# Altium schematic sheet Sata.SCHDOC: Ixora
size A3; Organization: Toradex AG; Address1: Altsagenstrasse 5; Address2: Horw; Address3: 6048; Address4: Switzerland; DocumentNumber: 17; Revision: V1.1; SheetNumber: 13; SheetTotal: 17; PageSetup: Record=PageOptions|CenterHorizontal=True|CenterVertical=True|PrintScale=0.73|XCorrection=1.00|YCorrection=1.00|PrintKind=0|BorderSize=5000000|LeftOffset=0|BottomOffset=0|Orientation=2|PaperLength=1000|PaperWidth=1000|Scale=100|PaperSource=7|PrintQuality=-4|MediaType=1|DitherType=10|PaperKind=A4|PrintScaleMode=1
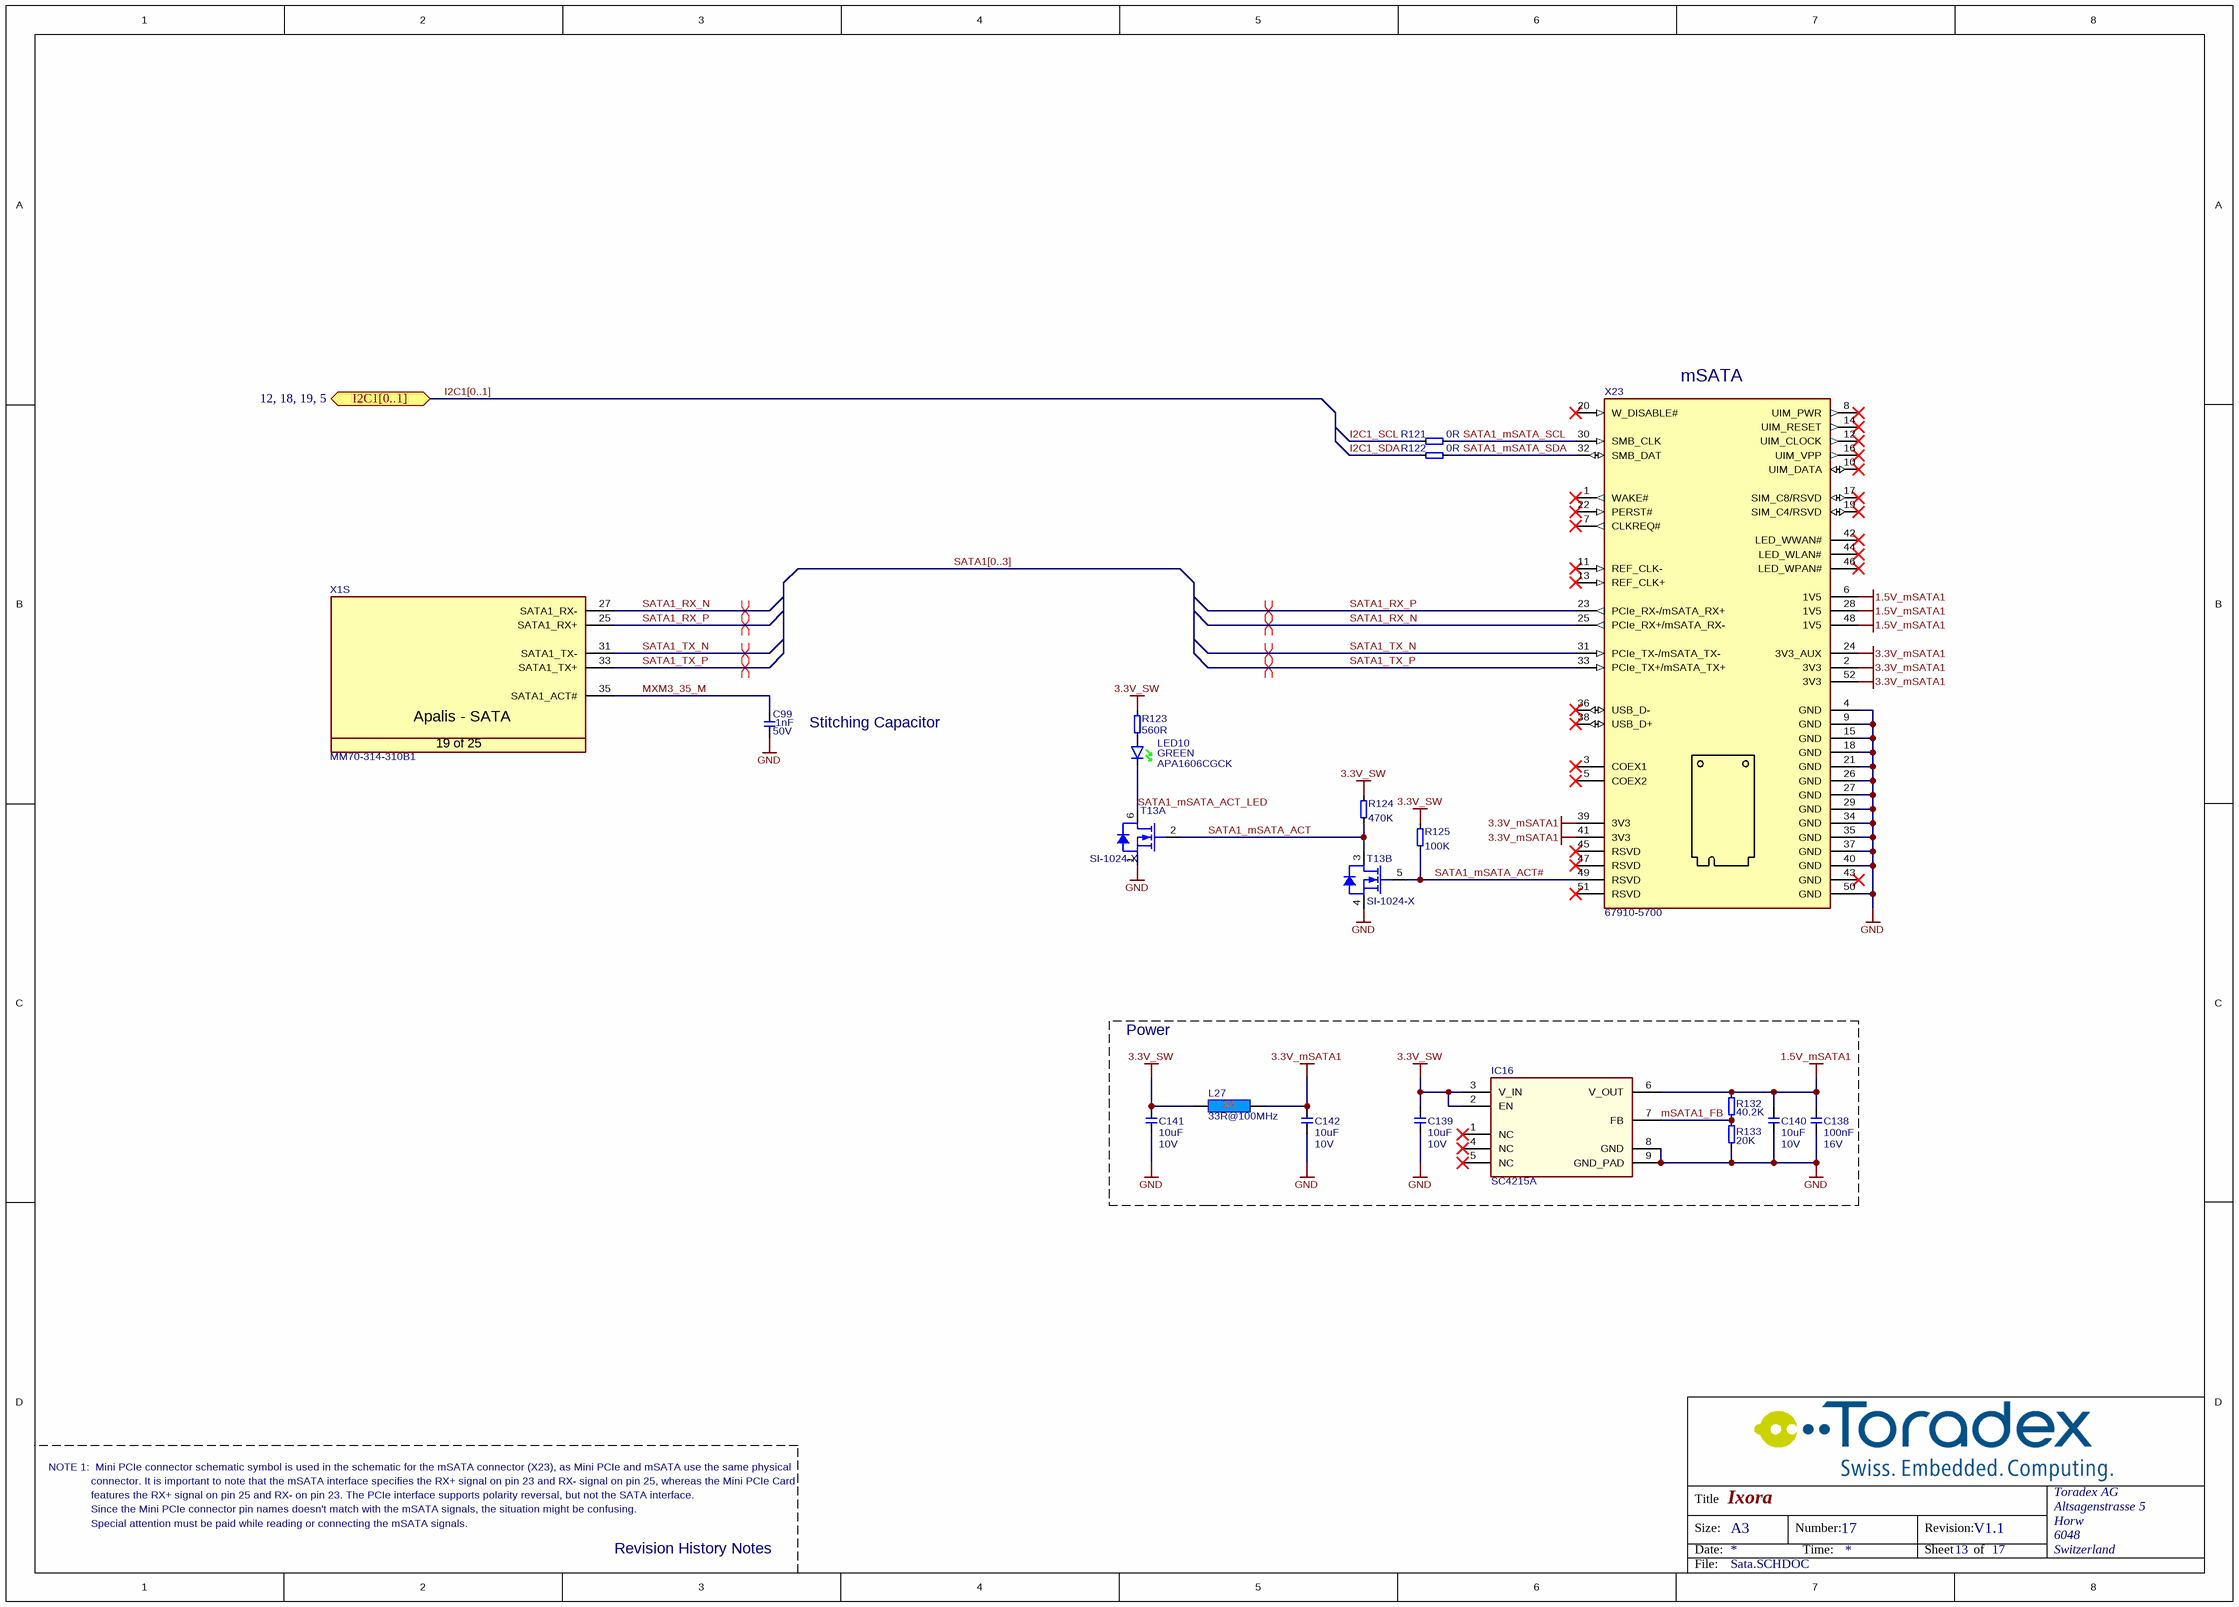
[diagram p0: Sata.SCHDOC]

## Parts
C99  Rating: 50V  [CAPC1005X60N]  (hidden comment: 1nF)
C138  Rating: 16V  [CAPC1005X60N]  (hidden comment: 100nF)
C139  Rating: 10V  [T_CAPC0603X33N]  (hidden comment: 10uF)
C140  Rating: 10V  [T_CAPC0603X33N]  (hidden comment: 10uF)
C141  Rating: 10V  [T_CAPC0603X33N]  (hidden comment: 10uF)
C142  Rating: 10V  [T_CAPC0603X33N]  (hidden comment: 10uF)
IC16  Manufacturer Part No.: SC4215A  [SOIC127P650X175_HS-8N]  (hidden comment: IC-Semtech-SC4215A)
L27  33R@100MHz  [INDC1608X95N]
LED10  Color: GREEN  [T_Kingbright_APA1606CGCK]  (hidden comment: APA1606CGCK)
R121  0R  [RESC1005X40N]
R122  0R  [RESC1005X40N]
R123  560R  [RESC1005X40N]
R124  470K  [RESC1005X40N]
R125  100K  [RESC1005X40N]
R132  40.2K  [RESC1005X40N]
R133  20K  [RESC1005X40N]
T13  Manufacturer Part No.: SI-1024-X  [SOTFL50P160X60-6N]  (hidden comment: T-Vishay-SI-1024X-N)  (parts A,B of 2)
X1  Manufacturer Part No.: MM70-314-310B1  [T_JAE_MM70-314-310B1]  (hidden comment: CON-JAE-MM70-314-310B1-314-0.5mm)  (part S of 25)
X23  67910-5700  [T_Molex_67910-5700]

## Blocks framed on the sheet
Power: C138-C142 IC16 L27 R132 R133

## Ports
I2C1[0..1] (bidir, see 12, 18, 19, 5)

## Nets
1.5V_mSATA1: C138.2 C140.2 IC16.6(V_OUT) R132.2 X23.6(1V5) X23.28(1V5) X23.48(1V5)
3.3V_mSATA1: C142.2 L27.2 X23.2(3V3) X23.24(3V3_AUX) X23.39(3V3) X23.41(3V3) X23.52(3V3)
3.3V_SW: C139.2 C141.2 IC16.2(EN) IC16.3(V_IN) L27.1 R123.1 R124.1 R125.2
GND: C99.1 C138.1 C139.1 C140.1 C141.1 C142.1 IC16.8(GND) IC16.9(GND_PAD) R133.1 T13.1(S) T13.4(S) X23.4(GND) X23.9(GND) X23.15(GND) X23.18(GND) X23.21(GND) X23.26(GND) X23.27(GND) X23.29(GND) X23.34(GND) X23.35(GND) X23.37(GND) X23.40(GND) X23.50(GND)
I2C1_SCL: R121.1
I2C1_SDA: R122.1
mSATA1_FB: IC16.7(FB) R132.1 R133.2
MXM3_35_M: C99.2 X1.35(SATA1_ACT#)
SATA1_mSATA_ACT: R124.2 T13.2(G) T13.3(D)
SATA1_mSATA_ACT#: R125.1 T13.5(G) X23.49(RSVD)
SATA1_mSATA_ACT_LED: LED10.1(K) T13.6(D)
SATA1_mSATA_SCL: R121.2 X23.30(SMB_CLK)
SATA1_mSATA_SDA: R122.2 X23.32(SMB_DAT)
SATA1_RX_N: X1.27(SATA1_RX-) X23.25(PCIe_RX+/mSATA_RX-)
SATA1_RX_P: X1.25(SATA1_RX+) X23.23(PCIe_RX-/mSATA_RX+)
SATA1_TX_N: X1.31(SATA1_TX-) X23.31(PCIe_TX-/mSATA_TX-)
SATA1_TX_P: X1.33(SATA1_TX+) X23.33(PCIe_TX+/mSATA_TX+)
NetLED10_2: LED10.2(A) R123.2

Not connected (* = marked no-connect by the designer): IC16 1(NC)* 4(NC)* 5(NC)*; X23 1(WAKE#)* 3(COEX1)* 5(COEX2)* 7(CLKREQ#)* 8(UIM_PWR)* 10(UIM_DATA)* 11(REF_CLK-)* 12(UIM_CLOCK)* 13(REF_CLK+)* 14(UIM_RESET)* 16(UIM_VPP)* 17(SIM_C8/RSVD)* 19(SIM_C4/RSVD)* 20(W_DISABLE#)* 22(PERST#)* 36(USB_D-)* 38(USB_D+)* 42(LED_WWAN#)* 43(GND)* 44(LED_WLAN#)* 45(RSVD)* 46(LED_WPAN#)* 47(RSVD)* 51(RSVD)*

## Buses and harness runs
bus I2C1[0..1] = port I2C1[0..1]
bus SATA1[0..3]

## Layout directives
differential pair: SATA1_RX_N, SATA1_RX_P, SATA1_TX_N, SATA1_TX_P

## Notes on the sheet
- (near X23) mSATA
- (near C99) Stitching Capacitor
- NOTE 1:  Mini PCIe connector schematic symbol is used in the schematic for the mSATA connector (X23), as Mini PCIe and mSATA use the same physical
- connector. It is important to note that the mSATA interface specifies the RX+ signal on pin 23 and RX- signal on pin 25, whereas the Mini PCIe Card
- Since the Mini PCIe connector pin names doesn't match with the mSATA signals, the situation might be confusing.
- features the RX+ signal on pin 25 and RX- on pin 23. The PCIe interface supports polarity reversal, but not the SATA interface.
- Special attention must be paid while reading or connecting the mSATA signals.
- Revision History Notes
- Title
- Size:
- Date:
- A3
- Number:
- Time:
- Revision:
- Sheet
- of
- File:
- (in symbol CON-JAE-MM70-314-310B1-314-0.5mm, part S) Apalis - SATA; 19 of 25

## Library data of the parts
C99 = C-X7R-1nF-50V-10%-0402: Capacitor Ceramic X7R 1nF 50V 10% 0402; Tolerance: 10%; Type: X7R; Value: 1nF
C138 = C-X7R-100nF-16V-10%-0402: Capacitor Ceramic X7R 100nF 16V 10% 0402; Tolerance: 10%; Type: X7R; Value: 100nF
C139-C142 = C-X5R-10uF-10V-20%-0603: Capacitor Ceramic X5R 10uF 10V 20% 0603; Tolerance: 20%; Type: X5R; Value: 10uF
IC16 = IC-Semtech-SC4215A: LDO TO 2A; Manufacturer Name: Semtech
L27 = L-33R@100MHz-3A-25%-0603: 33R@100MHz 3A EMI FILTER; Tolerance: 25%; Rating: 3A; Value: 33R@100MHz
LED10 = LED-Kingbright-APA1606CGCK: LED green Kingbright APA1606CGCK; Manufacturer Name: Kingbright; Manufacturer Part No.: APA1606CGCK
R121 R122 = R-0R-63mW-1%-0402: Resistor 0 ohm 63mW 1% 0402; Rating: 63mW; Tolerance: 1%; Value: 0R
R123 = R-560R-63mW-5%-0402: Resistor 560 ohm 63mW 5% 0402; Rating: 63mW; Tolerance: 5%; Value: 560R
R124 = R-470KR-63mW-5%-0402: Resistor 470 Kohm 63mW 5% 0402; Value: 470KR; Rating: 63mW; Tolerance: 5%
R125 = R-100KR-63mW-5%-0402: Resistor 100 Kohm 63mW 5% 0402; Value: 100KR; Rating: 63mW; Tolerance: 5%
R132 = R-40.2KR-63mW-1%-0402: Resistor 40.2 Kohm 63mW 1% 0402; Value: 40.2KR; Rating: 63mW; Tolerance: 1%
R133 = R-20KR-63mW-1%-0402: Resistor 20 Kohm 63mW 1% 0402; Value: 20KR; Rating: 63mW; Tolerance: 1%
T13 = T-Vishay-SI-1024X-N: Dual N-Channel 20V (D-S)  MOSFET; Manufacturer Name: Vishay
X1 = CON-JAE-MM70-314-310B1-314-0.5mm: MXM3 Connector; Manufacturer Name: JAE; No. of ways: 314
X23 = CON-Molex-67910-5700: PCIe_Mini Card Holder; Manufacturer Name: Molex; Part No.: 67910-5700